# EasyEDA schematic Lamp.json
TITLE: Dim controller Schema; REV: 1.0; Date: 2020-11-08; Sheet: 1/1; Drawn By: akoel; Company: Your Company
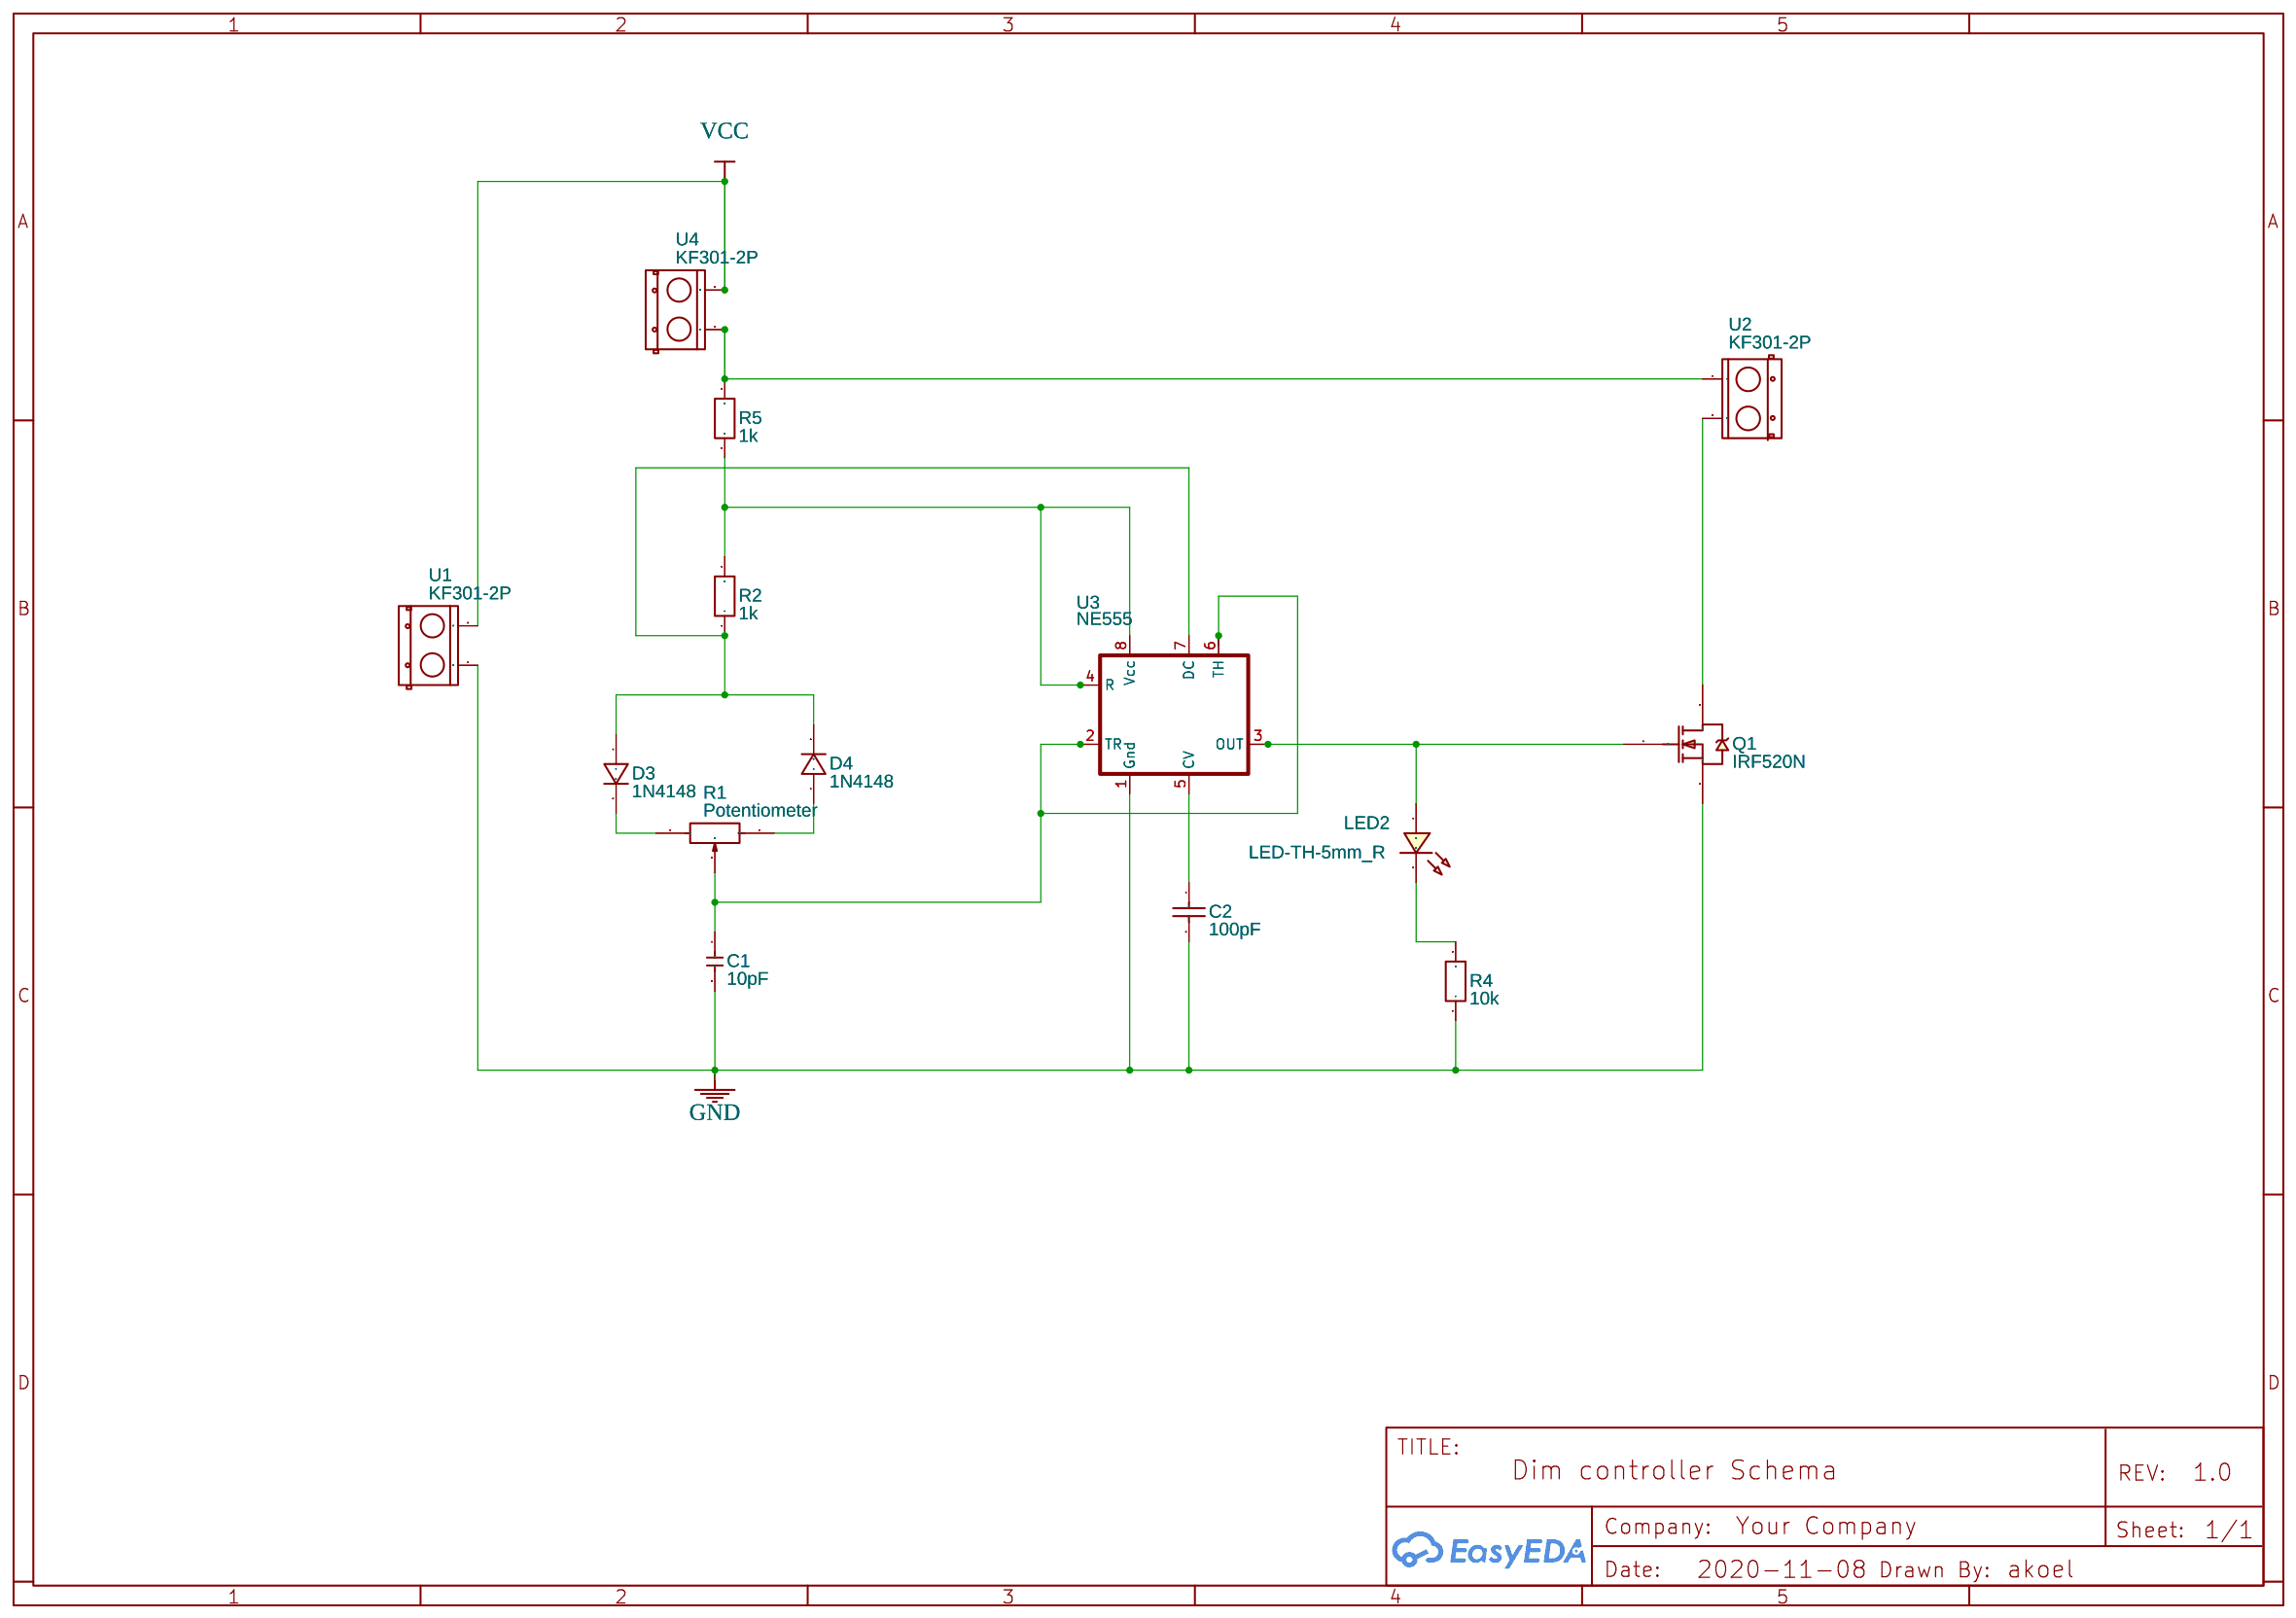
[diagram p0: schematic sheet]

## Parts
C1  10pF  [CERAMIC-2.54]
C2  100pF  [RAD-0.1]
D3  1N4148  [DO-35_BD2.0-L4.0-P8.00-D0.5-FD]
D4  1N4148  [DO-35_BD2.0-L4.0-P8.00-D0.5-FD]
LED2  LED-TH-5mm_R  [LED-TH_BD3.0_RED]
Q1  IRF520N  [TO-220AB]
R1  Potentiometer  [POTENTIOMETER_ALPS_RK163_SINGLE_VERTICAL]
R2  1k  [R_AXIAL-0.4]
R4  10k  [R_AXIAL-0.4]
R5  1k  [R_AXIAL-0.4]
U1  KF301-2P  [KF301]
U2  KF301-2P  [KF301]
U3  NE555  [NE555]
U4  KF301-2P  [KF301]

## Library data of the parts
C1 = 10pF: DIP CAP Ceramic Disc 100nF-50V-Y5V; Supplier Part: 302010208; Supplier: SeeedStudio; Manufacturer Part: CC1-F5SL2A101KSPW
C2 = 100pF: Voltage: 50V; Tolerance: ±10%; Supplier Part: C9339; Supplier: LCSC; Manufacturer: LCSC; Manufacturer Part: 100PF/50V10%
D3 D4 = 1N4148: Supplier: LCSC; Manufacturer: SEMTECH; Supplier Part: C14516; Contributor: LCEDA_Lib
LED2 = LED-TH-3mm_R: Manufacturer: EVERLIGHT(台湾亿光); Manufacturer Part: 204-10SDRD/S530-A3-L; Supplier Part: C84774; Supplier: LCSC; Contributor: LCEDA_Lib
Q1 = IRF520N: HEXFET Power MOSFET
R1 = Potentiometer: Contributor: zilvinus.peciulis
R2 R4 R5 = R_AXIAL-0.4_EU: Contributor: LCEDA_Lib
U1 U2 U4 = KF301-2P: Contributor: Slape_tex
U3 = NE555: Supplier: Romi; Contributor: S57PR

## Nets
GND: C1.2 C2.2 Q1.3(S) R4.1 U1.1 U3.1(Gnd)
VCC: U1.2 U4.2
Net-(C1-1): C1.1 R1.2 U3.2(TR) U3.6(TH)
Net-(C2-1): C2.1 U3.5(CV)
Net-(D3-1): D3.1 D4.2 R2.1 U3.7(DC)
Net-(D3-2): D3.2 R1.3
Net-(D4-1): D4.1 R1.1
Net-(LED2-1): LED2.1 Q1.1(G) U3.3(OUT)
Net-(LED2-2): LED2.2 R4.2
Net-(Q1-2): Q1.2(D) U2.2
Net-(R2-2): R2.2 R5.2 U3.4(R) U3.8(Vcc)
Net-(R5-1): R5.1 U2.1 U4.1
